# EAGLE design BottleBuddy (EAGLE 7.4.0)
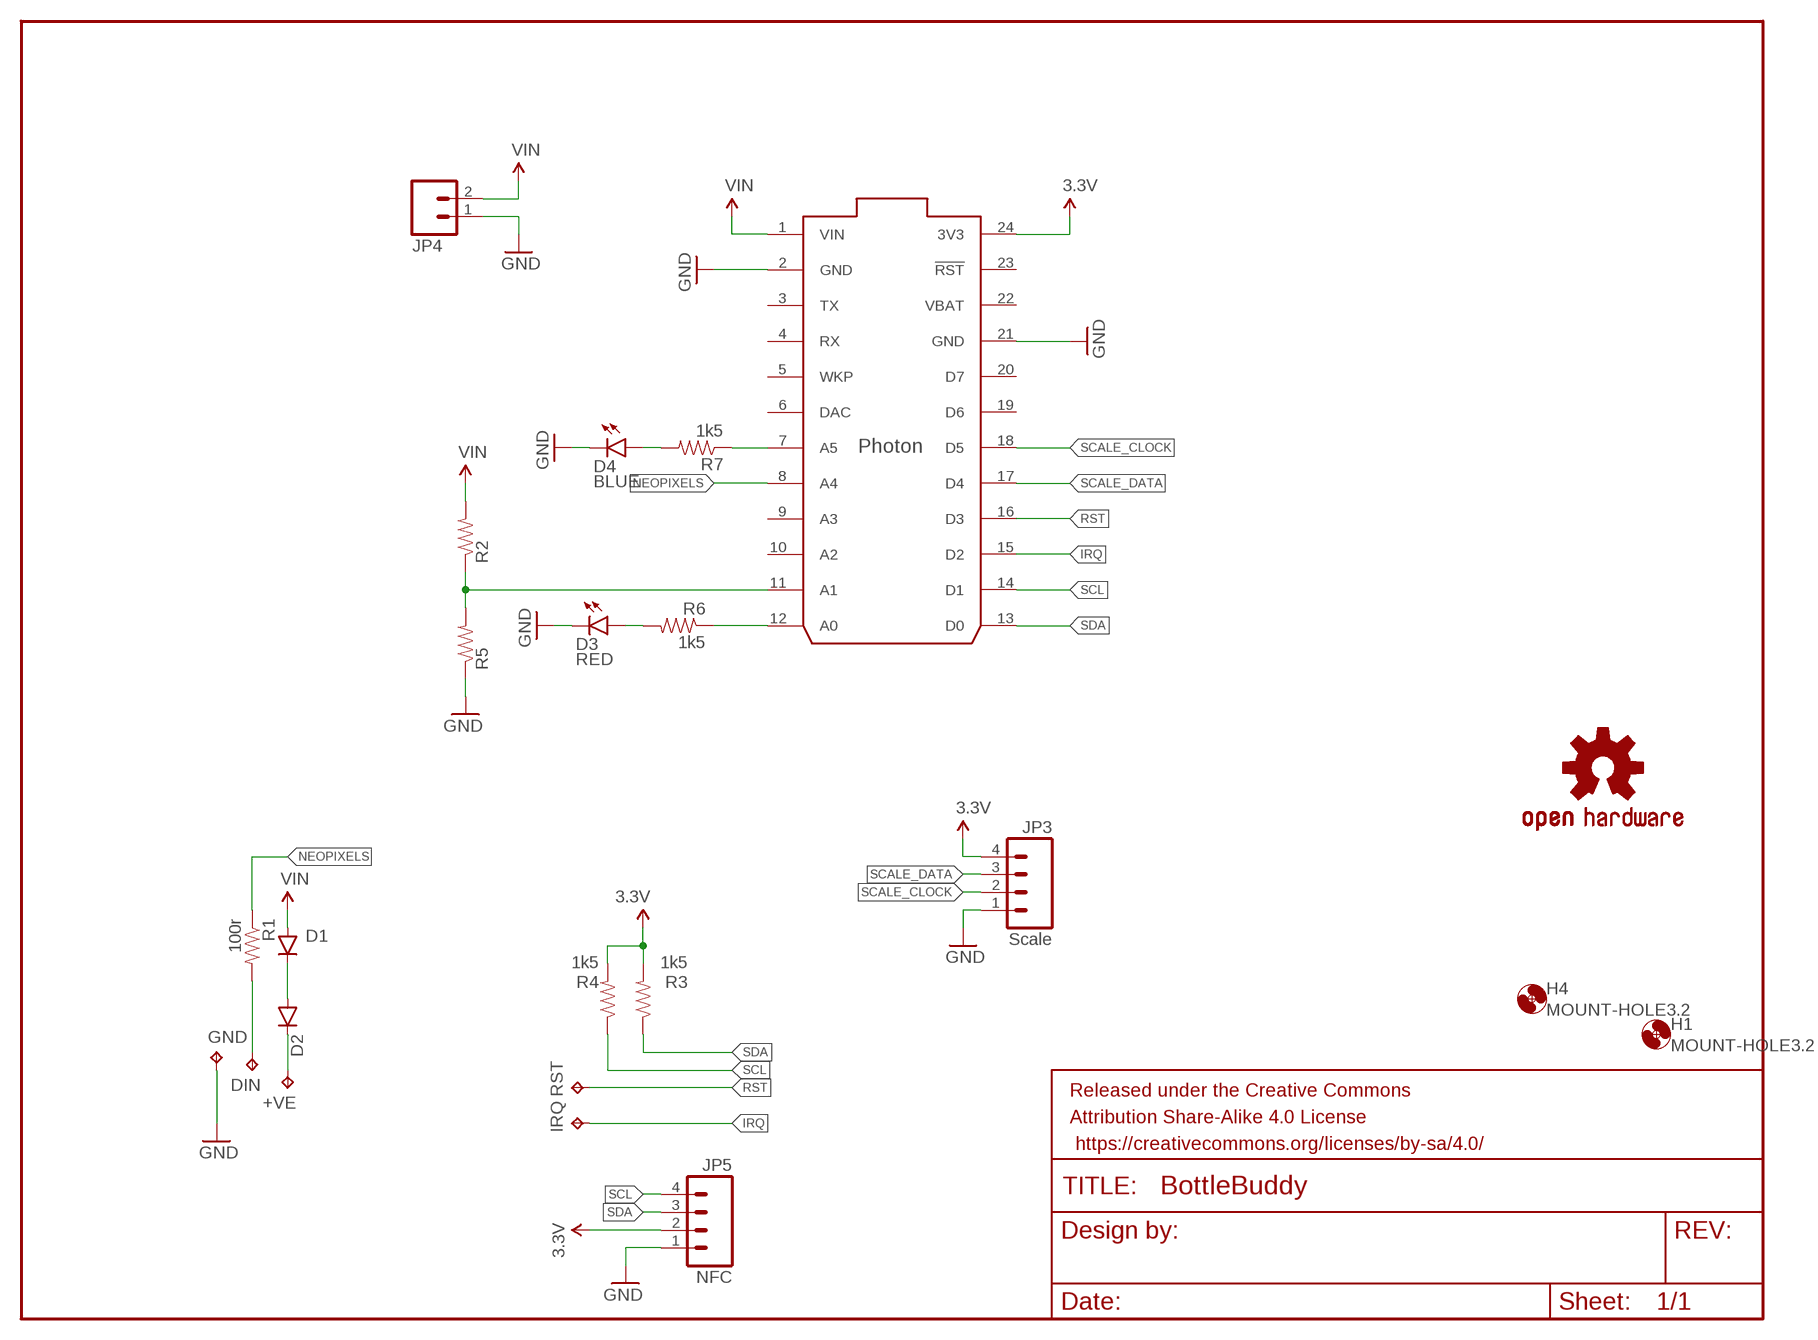
[diagram p0: schematic, sheet 1]

## Parts
+VE  TPTP20R  [TP20R]
D1  DIODESMA  [SMA-DIODE]
D2  DIODESMA  [SMA-DIODE]
D3  RED  LED1206  [LED-1206]
D4  BLUE  LED1206  [LED-1206]
DIN  TPTP20R  [TP20R]
FRAME1  FRAME-LETTER  [CREATIVE_COMMONS]
GND  TPTP20R  [TP20R]
H1  MOUNT-HOLE3.2  [3,2]
H4  MOUNT-HOLE3.2  [3,2]
IRQ  NFC IRQ  TPTP20R  [TP20R]
JP3  Scale  M04PTH  [1X04]
JP4  M02-JST-2MM-SMT  [JST-2-SMD]
JP5  NFC  M04PTH  [1X04]
LOGO2  OSHW-LOGOL  [OSHW-LOGO-L]
R1  100r  RESISTOR1206  [1206]
R2  RESISTOR1206  [1206]
R3  1k5  RESISTOR1206  [1206]
R4  1k5  RESISTOR1206  [1206]
R5  RESISTOR1206  [1206]
R6  1k5  RESISTOR1206  [1206]
R7  1k5  RESISTOR1206  [1206]
RST  TPTP20R  [TP20R]
U$1  PHOTON_WITH_HEADERS  [PHOTON]

## Nets
3.3V: JP3.4 JP5.2 R3.2 R4.2 U$1.24(3V3)
GND: D3.C D4.C GND.TP JP3.1 JP4.1 JP5.1 R5.1 U$1.2(GND) U$1.21(GND)
IRQ: IRQ.TP U$1.15(D2)
N$1: R7.1 U$1.7(A5)
N$2: R2.1 R5.2 U$1.11(A1)
N$3: D4.A R7.2
N$7: D1.C D2.A
N$8: +VE.TP D2.C
N$9: R6.1 U$1.12(A0)
N$13: D3.A R6.2
N$14: DIN.TP R1.2
NEOPIXELS: R1.1 U$1.8(A4)
RST: RST.TP U$1.16(D3)
SCALE_CLOCK: JP3.2 U$1.18(D5)
SCALE_DATA: JP3.3 U$1.17(D4)
SCL: JP5.4 R4.1 U$1.14(D1)
SDA: JP5.3 R3.1 U$1.13(D0)
VIN: D1.A JP4.2 R2.2 U$1.1(VIN)
Unconnected: U$1.3(TX) U$1.4(RX) U$1.5(WKP) U$1.6(DAC) U$1.9(A3) U$1.10(A2) U$1.19(D6) U$1.20(D7) U$1.23(!RST)

## Power pins joined to a net without a drawn wire
VBAT: U$1.22(VBAT)

## Library data of the parts
+VE DIN GND IRQ RST = testpad:TP: Test pad
D1 D2 = SparkFun-DiscreteSemi:DIODE: Diode These are standard reverse protection diodes and small signal diodes. SMA package can handle up to about 1A. SOD-323 can handle about 200mA. What the SOD-323 package when ordering, there are some mfgs out there that are 5-pin packages.
D3 D4 = SparkFun-LED:LED: LEDs Standard schematic elements and footprints for 5mm, 3mm, 1206, and 0603 sized LEDs. 5mm - Spark Fun Electronics SKU : COM-00529 (and others)
FRAME1 = SparkFun-Aesthetics:FRAME-LETTER: Schematic Frame Standard 8.5x11 US Letter frame
H1 H4 = holes:MOUNT-HOLE: MOUNTING HOLE with drill center marker
JP3 JP5 = SparkFun-Connectors:M04: Header 4 Standard 4-pin 0.1" header. Use with straight break away headers (SKU : PRT-00116), right angle break away headers (PRT-00553), swiss pins (PRT-00743), machine pins (PRT-00117), and female headers (PRT-00115). Molex polarized connector foot print use with SKU : PRT-08231 with associated crimp pins and housings. 1MM SMD Version SKU: PRT-10208
JP4 = SparkFun-Connectors:M02: Standard 2-pin 0.1" header. Use with - straight break away headers ( PRT-00116) - right angle break away headers (PRT-00553) - swiss pins (PRT-00743) - machine pins (PRT-00117) - female headers (PRT-00115) Molex polarized connector foot print use with: PRT-08233 with associated crimp pins and housings. 2.54_SCREWTERM for use with PRT-10571. 3.5mm Screw Terminal footprints for PRT-08084 5mm Screw Terminal footprints for use with PRT-08432; PROD_ID: CONN-11443
LOGO2 = SparkFun-Aesthetics:OSHW-LOGO: Open Source Hardware Logo This logo indicates the piece of hardware it is found on incorporates a OSHW license and/or adheres to the definition of open source hardware found here: http://freedomdefined.org/OSHW
R1-R7 = SparkFun-Resistors:RESISTOR: Resistor Basic schematic elements and footprints for 0603, 1206, and PTH resistors.
U$1 = Tinamous:PHOTON

## Board
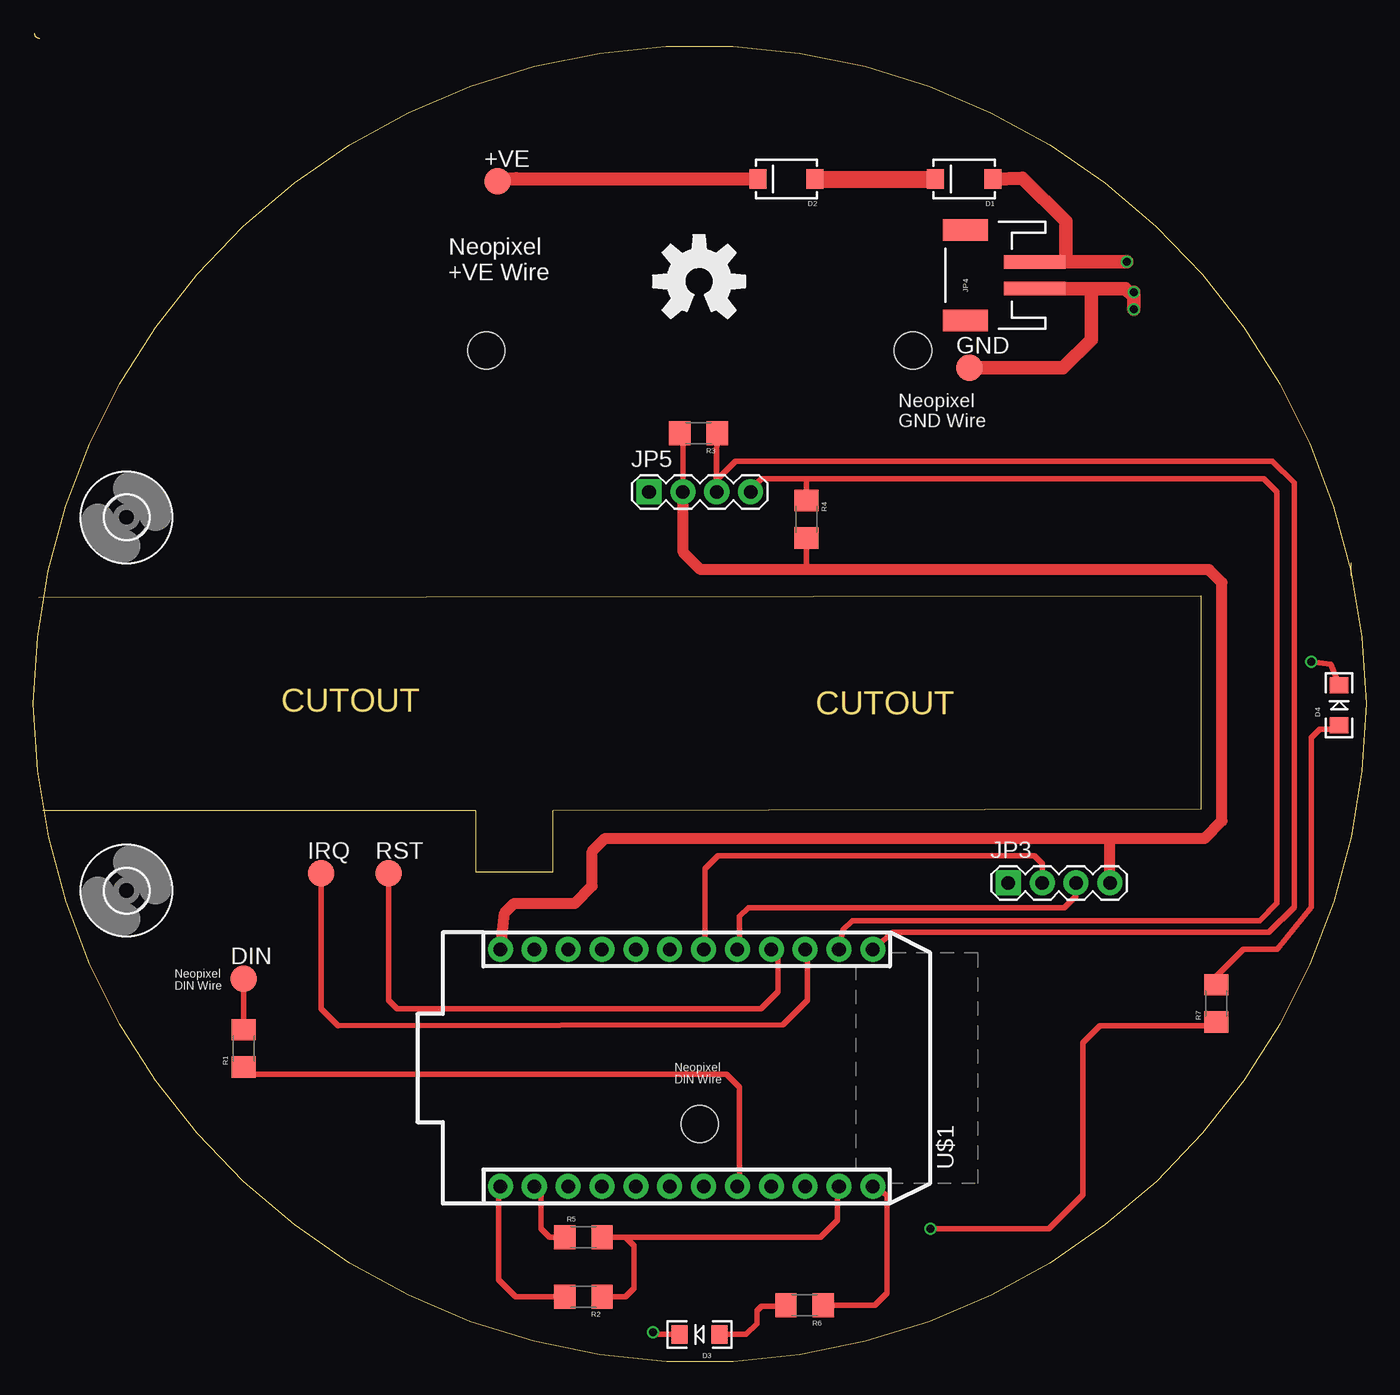
[diagram p1: board, top side]
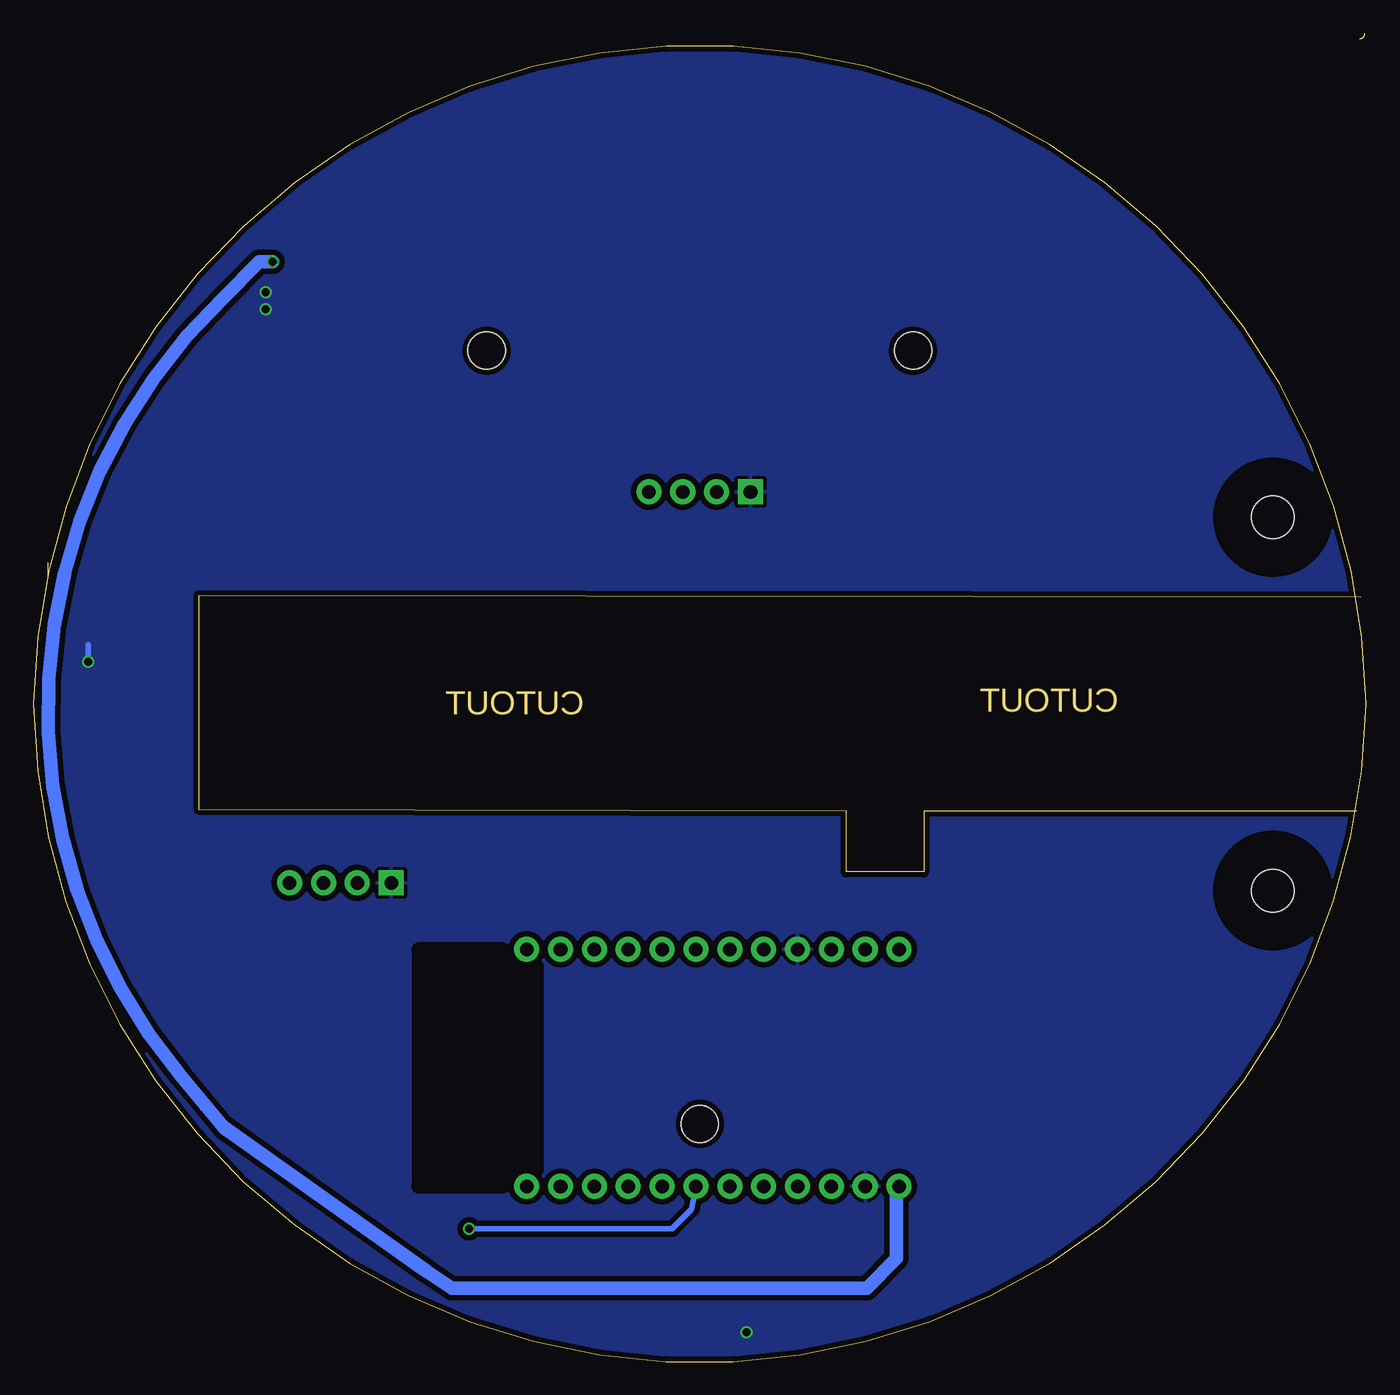
[diagram p2: board, bottom side, seen from below]

Size 100.01 x 99.63 mm. Coordinates in mm from the lower left corner, seen from the top.
Outline: 0.5,99.23 arc-90 0.1,99.63
Outline: 100,49.33 arc179 0,49.33 0.01,49.33 arc179 100.01,49.33
Outline: 0.4,57.33 87.6,57.43 87.6,41.43 39,41.33 39,36.73 33.2,36.73 33.2,41.33 0.7,41.33
Outline: 98.9,58.93 98.9,59.93
Copper layers (1*16): Top 0.035mm / dielectric 1.5mm / Bottom 0.035mm
Design rules "dirt_cheap_dirty_boards.v1": minimum track width 5mil, minimum drill 12mil, track to track 5mil, track to pad 5mil, pad to pad 5mil, via to via 5mil, smd to smd 0mil, copper to edge 10mil, drill to drill 10mil, minimum pad ring 10mil, minimum via ring 6mil, stop-mask expansion 2mil, vias tented up to drill 25mil, thermal gap 10mil
Holes 2.8 mm at 50,17.83 34,75.83 66,75.83
bRestrict: area 62.2,13.1 to 71.1,30.9

### Footprints (pad centres in the part's own frame; a part is rotated, then mirrored left to right if it is on the bottom)
TP20R = smd 2 x 2: TP 0,0
SMA-DIODE = smd 1.27 x 1.47: A -2.15,0; C 2.15,0
LED-1206 = smd 1.2 x 1.4: A -1.5,0; C 1.5,0
3,2 = hole 3.2: 0,0
1X04 = drill 1.016 pad 1.88 square: 1 0,0 | drill 1.016 pad 1.88: 2 2.54,0; 3 5.08,0; 4 7.62,0
JST-2-SMD = smd 1 x 4.6: 1 -1,-3.7; 2 1,-3.7 | smd 1.6 x 3.4: NC1 -3.4,1.5; NC2 3.4,1.5
1206 = smd 1.6 x 1.8: 1 -1.4,0; 2 1.4,0
PHOTON = drill 1.016 pad 1.88: 1 1.27,32.258; 2 1.27,29.718; 3 1.27,27.178; 4 1.27,24.638; 5 1.27,22.098; 6 1.27,19.558; 7 1.27,17.018; 8 1.27,14.478; 9 1.27,11.938; 10 1.27,9.398; 11 1.27,6.858; 12 1.27,4.318; 13 19.05,4.318; 14 19.05,6.858; 15 19.05,9.398; 16 19.05,11.938; 17 19.05,14.478; 18 19.05,17.018; 19 19.05,19.558; 20 19.05,22.098; 21 19.05,24.638; 22 19.05,27.178; 23 19.05,29.718; 24 19.05,32.258

### Placement (x,y rotation side)
+VE  34.84,88.53 0 top
D1  69.85,88.7 180 top
D2  56.52,88.7 180 top
D3  50,2.03 180 top
D4  97.99,49.22 90 top
DIN  15.8,28.73 0 top
FRAME1  18.7,-10.82 0 top  (outside the outline)
GND  70.25,74.53 0 top
H1  7,35.33 0 top
H4  7,63.33 0 top
IRQ  21.59,36.63 0 top
JP3  73.16,35.9 0 top
JP4  71.44,81.49 90 top
JP5  46.2,65.23 0 top
LOGO2  49.96,81.02 0 top
R1  15.78,23.49 90 top
R2  41.27,4.88 180 top
R3  49.91,69.65 180 top
R4  58.01,63.18 270 top
R5  41.27,9.32 0 top
R6  57.87,4.21 180 top
R7  88.78,26.86 90 top
RST  26.67,36.63 0 top
U$1  67.31,11.86 90 top

### Tracks (layer width: path | path; a pad name or v marks a point on that pad's centre or on a via)
3.3V
  Top 0.406: JP5.2 48.74,69.41 R3.2 | R4.2 58.01,59.54 57.87,59.41
  Top 0.813: U$1.24 35.37,33.65 36.09,34.37 40.64,34.37 41.94,35.67 41.94,38.27 42.92,39.25 80.63,39.25 | 80.63,39.25 87.89,39.25 89.19,40.55 89.19,58.43 88.22,59.41 57.87,59.41 50.07,59.41 48.77,60.71 48.77,64.2 JP5.2 | JP3.4 80.78,39.1 80.63,39.25
GND  (via drill 0.6)
  Top 0.406: D3.C 46.64,2.03 v46.49,2.19 | D4.C 97.35,52.31 v95.89,52.5 | R5.1 38.73,9.32 38.1,9.96 38.1,13.02 U$1.2
  Top 1.016: JP4.1 79.38,80.48 | 79.38,80.48 81.96,80.48 82.58,79.86 | v82.58,78.92 82.58,79.86 | v82.58,80.22 82.58,79.86 | GND.TP 77.27,74.53 79.38,76.63 79.38,79.21 79.38,80.48
  Bottom 0.406: v95.89,52.5 95.89,53.77
  pour Bottom (isolate 0.406, rank 5): -1,48.53 -0.9,70.53 26.3,97.63 36.8,97.63 39.8,100.63 62.1,100.63 66.2,96.53 74.3,96.53 101.4,69.43 100.6,29.63 73.9,-1.97 28.5,-0.87 4.4,17.23
IRQ
  Top 0.406: U$1.15 58.1,30.91 58.1,27.1 56.25,25.27 22.86,25.2 21.59,26.47 IRQ.TP
N$1  (via drill 0.6)
  Top 0.406: v67.31,9.96 76.2,9.96 78.74,12.5 78.74,23.93 80.01,25.2 88.9,25.2 R7.1
  Bottom 0.406: U$1.7 50.61,11.42 52.07,9.96 v67.31,9.96
N$2
  Top 0.406: 60.8,13.18 U$1.11 60.33,12.77 60.33,10.59 59.05,9.32 R5.2 44.45,9.32 45.09,8.69 45.09,5.51 44.45,4.88 R2.1
N$3
  Top 0.406: 97.79,47.52 D4.A 97.69,47.42 96.52,47.42 95.89,46.79 95.89,34.09 93.34,30.91 90.81,30.91 88.78,28.89 R7.2
N$7
  Top 1.27: D2.A D1.C
N$8
  Top 1.016: D2.C 36.22,88.72 34.92,88.7 34.92,88.61 +VE.TP
N$9
  Top 0.406: U$1.12 64.05,12.47 64.05,5.11 63.15,4.21 R6.1
N$13
  Top 0.406: D3.A 53.49,2.03 54.3,2.84 54.3,3.81 54.62,4.14 56.4,4.14 R6.2
N$14
  Top 0.406: R1.2 15.78,28.7 DIN.TP
NEOPIXELS
  Top 0.406: U$1.8 52.99,13.36 52.99,20.58 52.02,21.56 16.31,21.56 R1.1
RST
  Top 0.406: U$1.16 55.88,30.91 55.88,27.74 54.61,26.47 27.3,26.47 26.67,27.1 RST.TP
SCALE_CLOCK
  Top 0.406: JP3.2 75.7,37.35 75.1,37.95 51.37,37.95 50.39,36.97 50.39,31.2 U$1.18
SCALE_DATA
  Top 0.406: JP3.3 78.24,34.91 77.38,34.05 53.65,34.05 52.99,33.4 52.99,31.14 U$1.17
SCL
  Top 0.406: U$1.14 60.77,32.39 61.45,33.07 92.02,33.07 93.32,34.37 93.32,65.26 92.34,66.23 57.87,66.23 | 57.87,66.23 54.62,66.23 53.65,65.26 53.74,65.2 JP5.4 | R4.1 58.01,66.1 57.87,66.23
SDA
  Top 0.406: R3.1 51.21,65.45 JP5.3 51.27,65.32 51.37,66.23 52.67,67.53 92.98,67.53 94.61,65.91 94.61,34.33 94.61,34.09 92.71,32.18 64.5,32.18 U$1.13
VIN  (via drill 0.6)
  Top 0.406: R2.2 36.2,4.88 34.92,6.15 34.92,12.77 U$1.1
  Top 1.016: JP4.2 77.47,82.48 | 77.47,82.48 v82.05,82.48 | D1.A 74.22,88.77 77.47,85.52 77.47,83.12 77.47,82.48
  Bottom 1.016: v82.05,82.48 83.05,82.48 85.72,79.81 arc-86 88.9,21.39 85.72,17.58 70.48,6.78 68.58,5.51 37.47,5.51 35.24,7.73 35.24,12.45 U$1.1

### Text on the board
Dimension: CUTOUT | CUTOUT
tPlace: Neopixel / DIN Wire | Neopixel / DIN Wire
tNames: Neopixel / +VE Wire | Neopixel / GND Wire